# EAGLE schematic DP_current_measure_v3 (EAGLE 9.6.0)

## Sheet 1 of 5
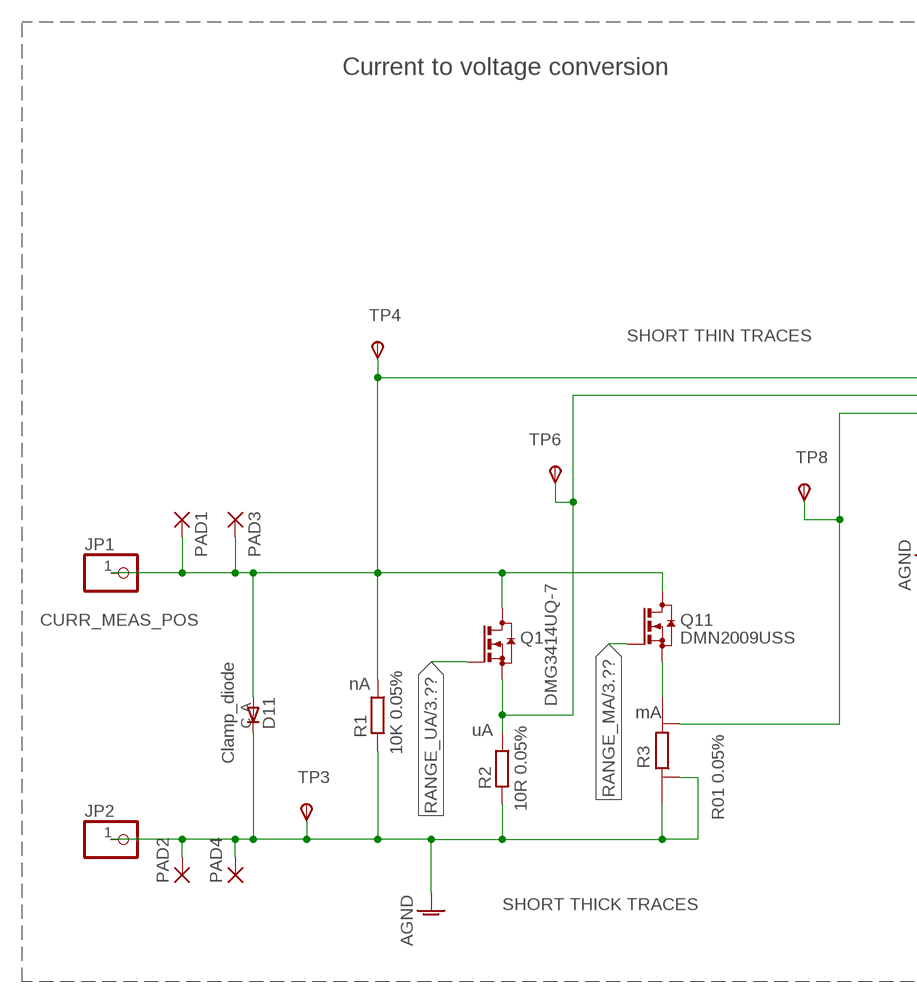
[diagram p0: schematic, sheet 1, part 1 of 2]
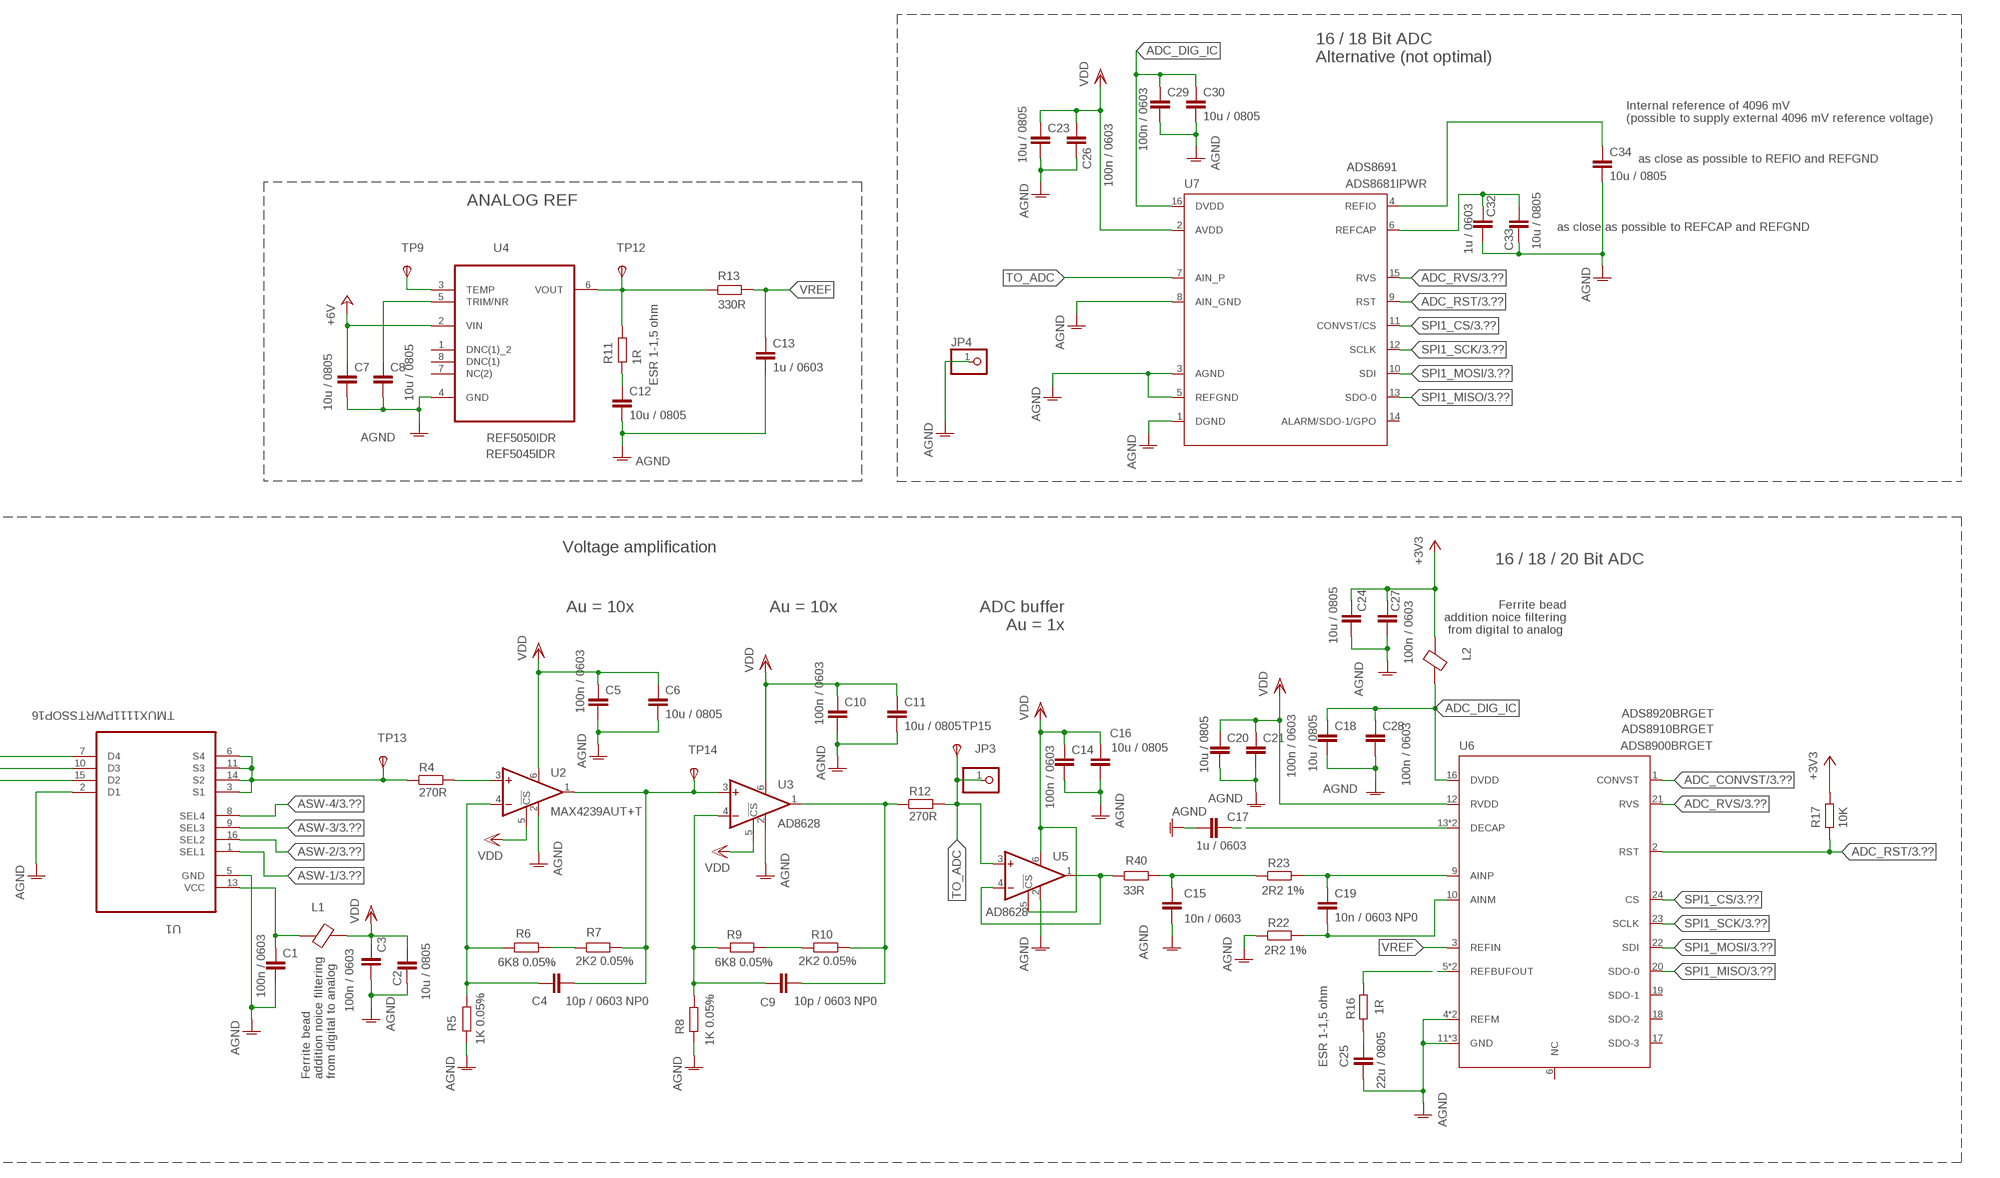
[diagram p1: schematic, sheet 1, part 2 of 2]

### Parts
C1  100n / 0603  C-EUC0603  [C0603]
C2  10u / 0805  C-EUC0805  [C0805]
C3  100n / 0603  C-EUC0603  [C0603]
C4  10p / 0603 NP0  C-EUC0603  [C0603]
C5  100n / 0603  C-EUC0603  [C0603]
C6  10u / 0805  C-EUC0805  [C0805]
C7  10u / 0805  C-EUC0805  [C0805]
C8  10u / 0805  C-EUC0805  [C0805]
C9  10p / 0603 NP0  C-EUC0603  [C0603]
C10  100n / 0603  C-EUC0603  [C0603]
C11  10u / 0805  C-EUC0805  [C0805]
C12  10u / 0805  C-EUC0805  [C0805]
C13  1u / 0603  C-EUC0603  [C0603]
C14  100n / 0603  C-EUC0603  [C0603]
C15  10n / 0603  C-EUC0603  [C0603]
C16  10u / 0805  C-EUC0805  [C0805]
C17  1u / 0603  C-EUC0603  [C0603]
C18  10u / 0805  C-EUC0805  [C0805]
C19  10n / 0603 NP0  C-EUC0603  [C0603]
C20  10u / 0805  C-EUC0805  [C0805]
C21  100n / 0603  C-EUC0603  [C0603]
C23  10u / 0805  C-EUC0805  [C0805]
C24  10u / 0805  C-EUC0805  [C0805]
C25  22u / 0805  C-EUC0805  [C0805]
C26  100n / 0603  C-EUC0603  [C0603]
C27  100n / 0603  C-EUC0603  [C0603]
C28  100n / 0603  C-EUC0603  [C0603]
C29  100n / 0603  C-EUC0603  [C0603]
C30  10u / 0805  C-EUC0805  [C0805]
C32  1u / 0603  C-EUC0603  [C0603]
C33  10u / 0805  C-EUC0805  [C0805]
C34  10u / 0805  C-EUC0805  [C0805]
D11  Clamp_diode  S1M  [DO214AC]
JP1  PINHD-1X1  [1X01]
JP2  PINHD-1X1  [1X01]
JP3  PINHD-1X1  [1X01]
JP4  PINHD-1X1  [1X01]
L1  BLM21PG331SN1D  [BLM21PG331SN1D]
L2  BLM21PG331SN1D  [BLM21PG331SN1D]
PAD1  WIREPADSMD2,54-5,08  [SMD2,54-5,08]
PAD2  WIREPADSMD2,54-5,08  [SMD2,54-5,08]
PAD3  WIREPADSMD2,54-5,08  [SMD2,54-5,08]
PAD4  WIREPADSMD2,54-5,08  [SMD2,54-5,08]
Q1  DMG3414UQ-7  [SOT23]
Q11  DMN2009USS  [SO8]
R1  10K 0.05%  R-EU_R0805  [R0805]
R2  10R 0.05%  R-EU_R0805  [R0805]
R3  R01 0.05%  CSM_R01  [R2512]
R4  270R  R-EU_R0603  [R0603]
R5  1K 0.05%  R-EU_R0603  [R0603]
R6  6K8 0.05%  R-EU_R0603  [R0603]
R7  2K2 0.05%  R-EU_R0603  [R0603]
R8  1K 0.05%  R-EU_R0603  [R0603]
R9  6K8 0.05%  R-EU_R0603  [R0603]
R10  2K2 0.05%  R-EU_R0603  [R0603]
R11  1R  R-EU_R0603  [R0603]
R12  270R  R-EU_R0603  [R0603]
R13  330R  R-EU_R0603  [R0603]
R16  1R  R-EU_R0603  [R0603]
R17  10K  R-EU_R0603  [R0603]
R22  2R2 1%  R-EU_R0603  [R0603]
R23  2R2 1%  R-EU_R0603  [R0603]
R40  33R  R-EU_R0603  [R0603]
TP3  TPSB1,27  [B1,27]
TP4  TPSB1,27  [B1,27]
TP6  TPSB1,27  [B1,27]
TP8  TPSB1,27  [B1,27]
TP9  TPSB1,27  [B1,27]
TP12  TPSB1,27  [B1,27]
TP13  TPSB1,27  [B1,27]
TP14  TPSB1,27  [B1,27]
TP15  TPSB1,27  [B1,27]
U1  TMUX1111PWRTSSOP16  [SOP65P640X110-16N]
U2  MAX4239AUT+T  [SOT23-6]
U3  AD8628  MAX4239AUT+T  [SOT23-6]
U4  REF5050IDR  [SOIC127P600X175-8N]
U5  AD8628  MAX4239AUT+T  [SOT23-6]
U6  ADS8900BRGET  ADS8910BRGET  [24-VFQFN]
U7  ADS8681IPWR  [SOP65P640X120-16N]

### Nets
+3V3: C24.1 C27.1 L2.2 R17.2 ; also sheet 2,3,4,5
+6V: C7.1 U4.2(VIN) ; also sheet 2
ADC_CONVST: U6.1(CONVST) ; also sheet 3
ADC_DIG_IC: C18.1 C28.1 C29.1 C30.1 L2.1 U6.16(DVDD) U7.16(DVDD)
ADC_RST: R17.1 U6.2(RST) U7.9(RST) ; also sheet 3
ADC_RVS: U6.21(RVS) U7.15(RVS) ; also sheet 3
AGND: C1.2 C2.2 C3.2 C5.2 C6.2 C7.2 C8.2 C10.2 C11.2 C12.2 C13.2 C14.2 C15.2 C16.2 C17.2 C18.2 C20.2 C21.2 C23.2 C24.2 C25.2 C26.2 C27.2 C28.2 C29.2 C30.2 C32.2 C33.2 C34.2 D11.C JP2.1 JP4.1 PAD2.1(P) PAD4.1(P) R1.2 R2.2 R3.E1 R3.I1 R5.1 R8.2 R22.1 TP3.TP(PP) U1.2(D1) U1.5(GND) U2.2(V-) U3.2(V-) U4.4(GND) U5.2(V-) U6.4(REFM) U6.8(REFM) U6.11(GND) U6.15(GND) U6.25(GND) U7.1(DGND) U7.3(AGND) U7.5(REFGND) U7.8(AIN_GND) ; also sheet 2,3
ASW-1: U1.1(SEL1) ; also sheet 3
ASW-2: U1.16(SEL2) ; also sheet 3
ASW-3: U1.9(SEL3) ; also sheet 3
ASW-4: U1.8(SEL4) ; also sheet 3
CURR_MEAS_POS: D11.A JP1.1 PAD1.1(P) PAD3.1(P) Q1.3(D) Q11.5(D) Q11.6(D) Q11.7(D) Q11.8(D) R1.1 TP4.TP(PP) U1.7(D4)
MA_RANGE_SENSE: R3.E2 TP8.TP(PP) U1.15(D2)
MA_RANGE_SENSE_Q: Q11.1(S) Q11.2(S) Q11.3(S) R3.I2
N$1: C9.2 R10.1 R12.1 U3.1(OUT)
N$2: R9.1 R10.2
N$3: C9.1 R8.1 R9.2 U3.4(-IN)
N$4: R6.2 R7.1
N$5: C4.2 R7.2 TP14.TP(PP) U2.1(OUT) U3.3(+IN)
N$6: R4.1 TP13.TP(PP) U1.3(S1) U1.6(S4) U1.11(S3) U1.14(S2)
N$7: C4.1 R5.2 R6.1 U2.4(-IN)
N$8: C1.1 L1.1 U1.13(VCC)
N$14: C15.1 R23.1 R40.2
N$15: R4.2 U2.3(+IN)
N$17: C19.2 R22.2 U6.10(AINM)
N$24: C8.1 U4.5(TRIM/NR)
N$40: C32.1 C33.1 U7.6(REFCAP)
N$41: C34.1 U7.4(REFIO)
N$47: TP9.TP(PP) U4.3(TEMP)
N$48: R16.2 U6.5(REFBUFOUT) U6.7(REFBUFOUT)
N$49: C25.1 R16.1
N$50: C17.1 U6.13(DECAP) U6.14(DECAP)
N$51: R40.1 U5.1(OUT) U5.4(-IN)
N$59: C12.1 R11.2
N$62: C19.1 R23.2 U6.9(AINP)
RANGE_MA: Q11.4(G) ; also sheet 3
RANGE_UA: Q1.1(G) ; also sheet 3
SPI1_CS: U6.24(CS) U7.11(CONVST/CS) ; also sheet 3
SPI1_MISO: U6.20(SDO-0) U7.13(SDO-0) ; also sheet 3
SPI1_MOSI: U6.22(SDI) U7.10(SDI) ; also sheet 3
SPI1_SCK: U6.23(SCLK) U7.12(SCLK) ; also sheet 3
TO_ADC: JP3.1 R12.2 TP15.TP(PP) U5.3(+IN) U7.7(AIN_P)
UA_RANGE_SENSE: Q1.2(S) R2.1 TP6.TP(PP) U1.10(D3)
VDD: C2.1 C3.1 C5.1 C6.1 C10.1 C11.1 C14.1 C16.1 C20.1 C21.1 C23.1 C26.1 L1.2 U2.5(!CS) U2.6(V+) U3.5(!CS) U3.6(V+) U5.5(!CS) U5.6(V+) U6.12(RVDD) U7.2(AVDD) ; also sheet 2
VREF: C13.1 R13.2 U6.3(REFIN)
VREF_IC: R11.1 R13.1 TP12.TP(PP) U4.6(VOUT)
Unconnected: U4.1(DNC(1)_2) U4.7(NC(2)) U4.8(DNC(1)) U6.6(NC) U6.17(SDO-3) U6.18(SDO-2) U6.19(SDO-1) U7.14(ALARM/SDO-1/GPO)

### Notes on the sheet
- 16 / 18 Bit ADC
  Alternative (not optimal)
- Internal reference of 4096 mV 
  (possible to supply external 4096 mV reference voltage)
- as close as possible to REFIO and REFGND
- ADS8691
- ANALOG REF
- as close as possible to REFCAP and REFGND
- ESR 1-1,5 ohm
- REF5045IDR
- Current to voltage conversion | Voltage amplification
- 16 / 18 / 20 Bit ADC
- Au = 10x | Au = 10x
- ADC buffer
  Au = 1x
- Ferrite bead
  addition noice filtering
  from digital to analog
- ADS8920BRGET
- SHORT THIN TRACES | ADS8910BRGET
- nA
- mA
- uA
- ESR 1-1,5 ohm
- Ferrite bead
  addition noice filtering
  from digital to analog
- SHORT THICK TRACES

## Sheet 2 of 5
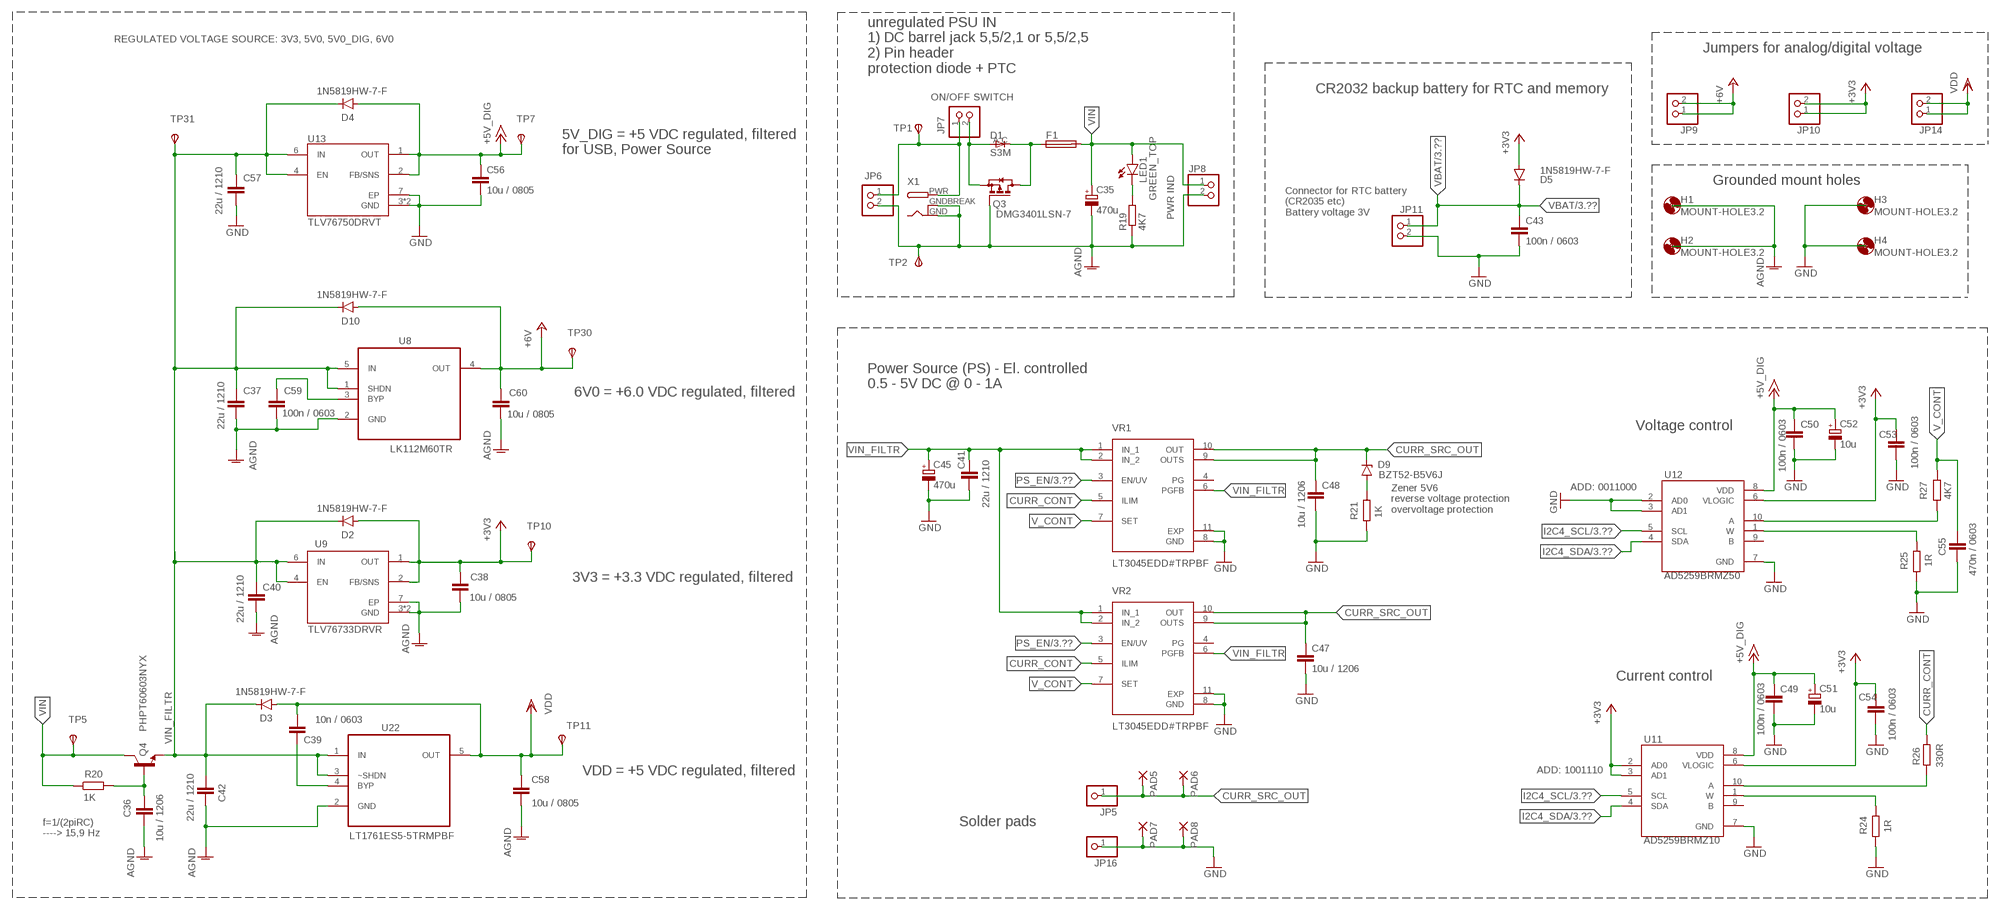
[diagram p2: schematic, sheet 2]

### Parts
C35  470u  CPOL-EUG  [PANASONIC_G]
C36  10u / 1206  C-EUC1206  [C1206]
C37  22u / 1210  C-EUC1210  [C1210]
C38  10u / 0805  C-EUC0805  [C0805]
C39  10n / 0603  C-EUC0603  [C0603]
C40  22u / 1210  C-EUC1210  [C1210]
C41  22u / 1210  C-EUC1210  [C1210]
C42  22u / 1210  C-EUC1210  [C1210]
C43  100n / 0603  C-EUC0603  [C0603]
C45  470u  CPOL-EUG  [PANASONIC_G]
C47  10u / 1206  C-EUC1206  [C1206]
C48  10u / 1206  C-EUC1206  [C1206]
C49  100n / 0603  C-EUC0603  [C0603]
C50  100n / 0603  C-EUC0603  [C0603]
C51  10u  CPOL-EUSMCB  [SMC_B]
C52  10u  CPOL-EUSMCB  [SMC_B]
C53  100n / 0603  C-EUC0603  [C0603]
C54  100n / 0603  C-EUC0603  [C0603]
C55  470n / 0603  C-EUC0603  [C0603]
C56  10u / 0805  C-EUC0805  [C0805]
C57  22u / 1210  C-EUC1210  [C1210]
C58  10u / 0805  C-EUC0805  [C0805]
C59  100n / 0603  C-EUC0603  [C0603]
C60  10u / 0805  C-EUC0805  [C0805]
D1  S3M  S1M  [DO214AC]
D2  1N5819HW-7-F  CGRM4001-G  [SOD-123_MINI-SMA]
D3  1N5819HW-7-F  CGRM4001-G  [SOD-123_MINI-SMA]
D4  1N5819HW-7-F  CGRM4001-G  [SOD-123_MINI-SMA]
D5  1N5819HW-7-F  CGRM4001-G  [SOD-123_MINI-SMA]
D9  BZT52-B5V6J  ZENER_MMSZ5240BTDO-219-AB(SOD123F)  [SODFL3718X115]
D10  1N5819HW-7-F  CGRM4001-G  [SOD-123_MINI-SMA]
F1  MF-MSMF050-2  [1812]
H1  MOUNT-HOLE3.2  [3,2]
H2  MOUNT-HOLE3.2  [3,2]
H3  MOUNT-HOLE3.2  [3,2]
H4  MOUNT-HOLE3.2  [3,2]
JP5  PINHD-1X1  [1X01]
JP6  PINHD-1X2  [1X02]
JP7  PINHD-1X2  [1X02]
JP8  PINHD-1X2  [1X02]
JP9  PINHD-1X2  [1X02]
JP10  PINHD-1X2  [1X02]
JP11  PINHD-1X2  [1X02]
JP14  PINHD-1X2  [1X02]
JP16  PINHD-1X1  [1X01]
LED1  GREEN_TOP  LEDCHIP-LED0603  [CHIP-LED0603]
PAD5  WIREPADSMD2,54-5,08  [SMD2,54-5,08]
PAD6  WIREPADSMD2,54-5,08  [SMD2,54-5,08]
PAD7  WIREPADSMD2,54-5,08  [SMD2,54-5,08]
PAD8  WIREPADSMD2,54-5,08  [SMD2,54-5,08]
Q3  DMG3401LSN-7  [SOT23]
Q4  PHPT60603NYX  [TO127P600X120-5N]
R19  4K7  R-EU_R0603  [R0603]
R20  1K  R-EU_R0603  [R0603]
R21  1K  R-EU_R0603  [R0603]
R24  1R  R-EU_R0603  [R0603]
R25  1R  R-EU_R0603  [R0603]
R26  330R  R-EU_R0603  [R0603]
R27  4K7  R-EU_R0603  [R0603]
TP1  TPSB1,27  [B1,27]
TP2  TPSB1,27  [B1,27]
TP5  TPSB1,27  [B1,27]
TP7  TPSB1,27  [B1,27]
TP10  TPSB1,27  [B1,27]
TP11  TPSB1,27  [B1,27]
TP30  TPSB1,27  [B1,27]
TP31  TPSB1,27  [B1,27]
U8  LK112M60TR  [SOT23-5]
U9  TLV76733DRVR  TLV76701DRVT  [SON65P200X200X80-7N]
U11  AD5259BRMZ10  AD5259BRMZ5  [SOP50P490X95-10N]
U12  AD5259BRMZ50  AD5259BRMZ5  [SOP50P490X95-10N]
U13  TLV76750DRVT  TLV76701DRVT  [SON65P200X200X80-7N]
U22  LT1761ES5-5TRMPBF  [SOT95P280X100-5N]
VR1  LT3045EDD#TRPBF  [SON50P300X300X80-11N]
VR2  LT3045EDD#TRPBF  [SON50P300X300X80-11N]
X1  DCBARRELPTH  [DCJACK_2MM_PTH]

### Nets
+3V3: C38.1 C53.1 C54.1 D2.A D5.A JP10.1 JP10.2 TP10.TP(PP) U9.1(OUT) U9.2(FB/SNS) U11.2(AD0) U11.3(AD1) U11.6(VLOGIC) U12.6(VLOGIC) ; also sheet 1,3,4,5
+5V_DIG: C49.1 C50.1 C51.+ C52.+ C56.1 D4.A TP7.TP(PP) U11.8(VDD) U12.8(VDD) U13.1(OUT) U13.2(FB/SNS) ; also sheet 4
+6V: C60.1 D10.A JP9.1 JP9.2 TP30.TP(PP) U8.4(OUT) ; also sheet 1
AGND: C35.- C36.2 C37.2 C38.2 C40.2 C42.2 C58.2 C59.2 C60.2 JP6.2 JP8.2 Q3.1(G) R19.1 TP2.TP(PP) U8.2(GND) U9.3(GND) U9.5(GND) U9.7(EP) U22.2(GND) X1.GND X1.GNDBREAK ; also sheet 1,3
CURR_CONT: R26.2 VR1.5(ILIM) VR2.5(ILIM)
CURR_CONT_LOW: R24.2 U11.1(W)
CURR_POT_HIGH: R26.1 U11.10(A)
CURR_SRC_OUT: C47.1 C48.1 D9.2(C) JP5.1 PAD5.1(P) PAD6.1(P) VR1.9(OUTS) VR1.10(OUT) VR2.9(OUTS) VR2.10(OUT)
GND: C41.2 C43.2 C45.- C47.2 C48.2 C49.2 C50.2 C51.- C52.- C53.2 C54.2 C55.2 C56.2 C57.2 JP11.2 JP16.1 PAD7.1(P) PAD8.1(P) R21.1 R24.1 R25.1 U11.7(GND) U12.2(AD0) U12.3(AD1) U12.7(GND) U13.3(GND) U13.5(GND) U13.7(EP) VR1.8(GND) VR1.11(EXP) VR2.8(GND) VR2.11(EXP) ; also sheet 3,4,5
I2C4_SCL: U11.5(SCL) U12.5(SCL) ; also sheet 3,4
I2C4_SDA: U11.4(SDA) U12.4(SDA) ; also sheet 3,4
N$16: D9.1(A) R21.2
N$20: C59.1 U8.3(BYP)
N$23: C36.1 Q4.4(B) R20.2
N$39: D1.C F1.1 Q3.3(D)
N$42: D1.A JP7.2 Q3.2(S)
N$44: LED1.C R19.2
N$63: JP6.1 JP7.1 TP1.TP(PP) X1.PWR
PS_EN: VR1.3(EN/UV) VR2.3(EN/UV) ; also sheet 3
REG_BYPAS: C39.1 U22.4(BYP)
V_CONT: C55.1 R27.2 VR1.7(SET) VR2.7(SET)
V_CONT_LOW: R25.2 U12.1(W)
V_POT_HIGH: R27.1 U12.10(A)
VBAT: C43.1 D5.C JP11.1 ; also sheet 3
VDD: C39.2 C58.1 D3.A JP14.1 JP14.2 TP11.TP(PP) U22.5(OUT) ; also sheet 1
VIN: C35.+ F1.2 JP8.1 LED1.A Q4.5(C) R20.1 TP5.TP(PP)
VIN_FILTR: C37.1 C40.1 C41.1 C42.1 C45.+ C57.1 D2.C D3.C D4.C D10.C Q4.1(E) Q4.2(E) Q4.3(E) TP31.TP(PP) U8.1(SHDN) U8.5(IN) U9.4(EN) U9.6(IN) U13.4(EN) U13.6(IN) U22.1(IN) U22.3(~SHDN) VR1.1(IN_1) VR1.2(IN_2) VR1.6(PGFB) VR2.1(IN_1) VR2.2(IN_2) VR2.6(PGFB)
Unconnected: U11.9(B) U12.9(B) VR1.4(PG) VR2.4(PG)

### Notes on the sheet
- REGULATED VOLTAGE SOURCE: 3V3, 5V0, 5V0_DIG, 6V0
- Jumpers for analog/digital voltage
- unregulated PSU IN
  1) DC barrel jack 5,5/2,1 or 5,5/2,5
  2) Pin header
  protection diode + PTC
- CR2032 backup battery for RTC and memory
- ON/OFF SWITCH
- 5V_DIG = +5 VDC regulated, filtered
  for USB, Power Source
- Grounded mount holes
- Connector for RTC battery
  (CR2035 etc)
  Battery voltage 3V
- PWR IND
- Power Source (PS) - El. controlled
  0.5 - 5V DC @ 0 - 1A
- 6V0 = +6.0 VDC regulated, filtered
- Voltage control
- ADD: 0011000
- Zener 5V6
  reverse voltage protection
  overvoltage protection
- 3V3 = +3.3 VDC regulated, filtered
- Current control
- VDD = +5 VDC regulated, filtered | ADD: 1001110
- Solder pads
- f=1/(2piRC) 
  ----> 15,9 Hz

## Sheet 3 of 5
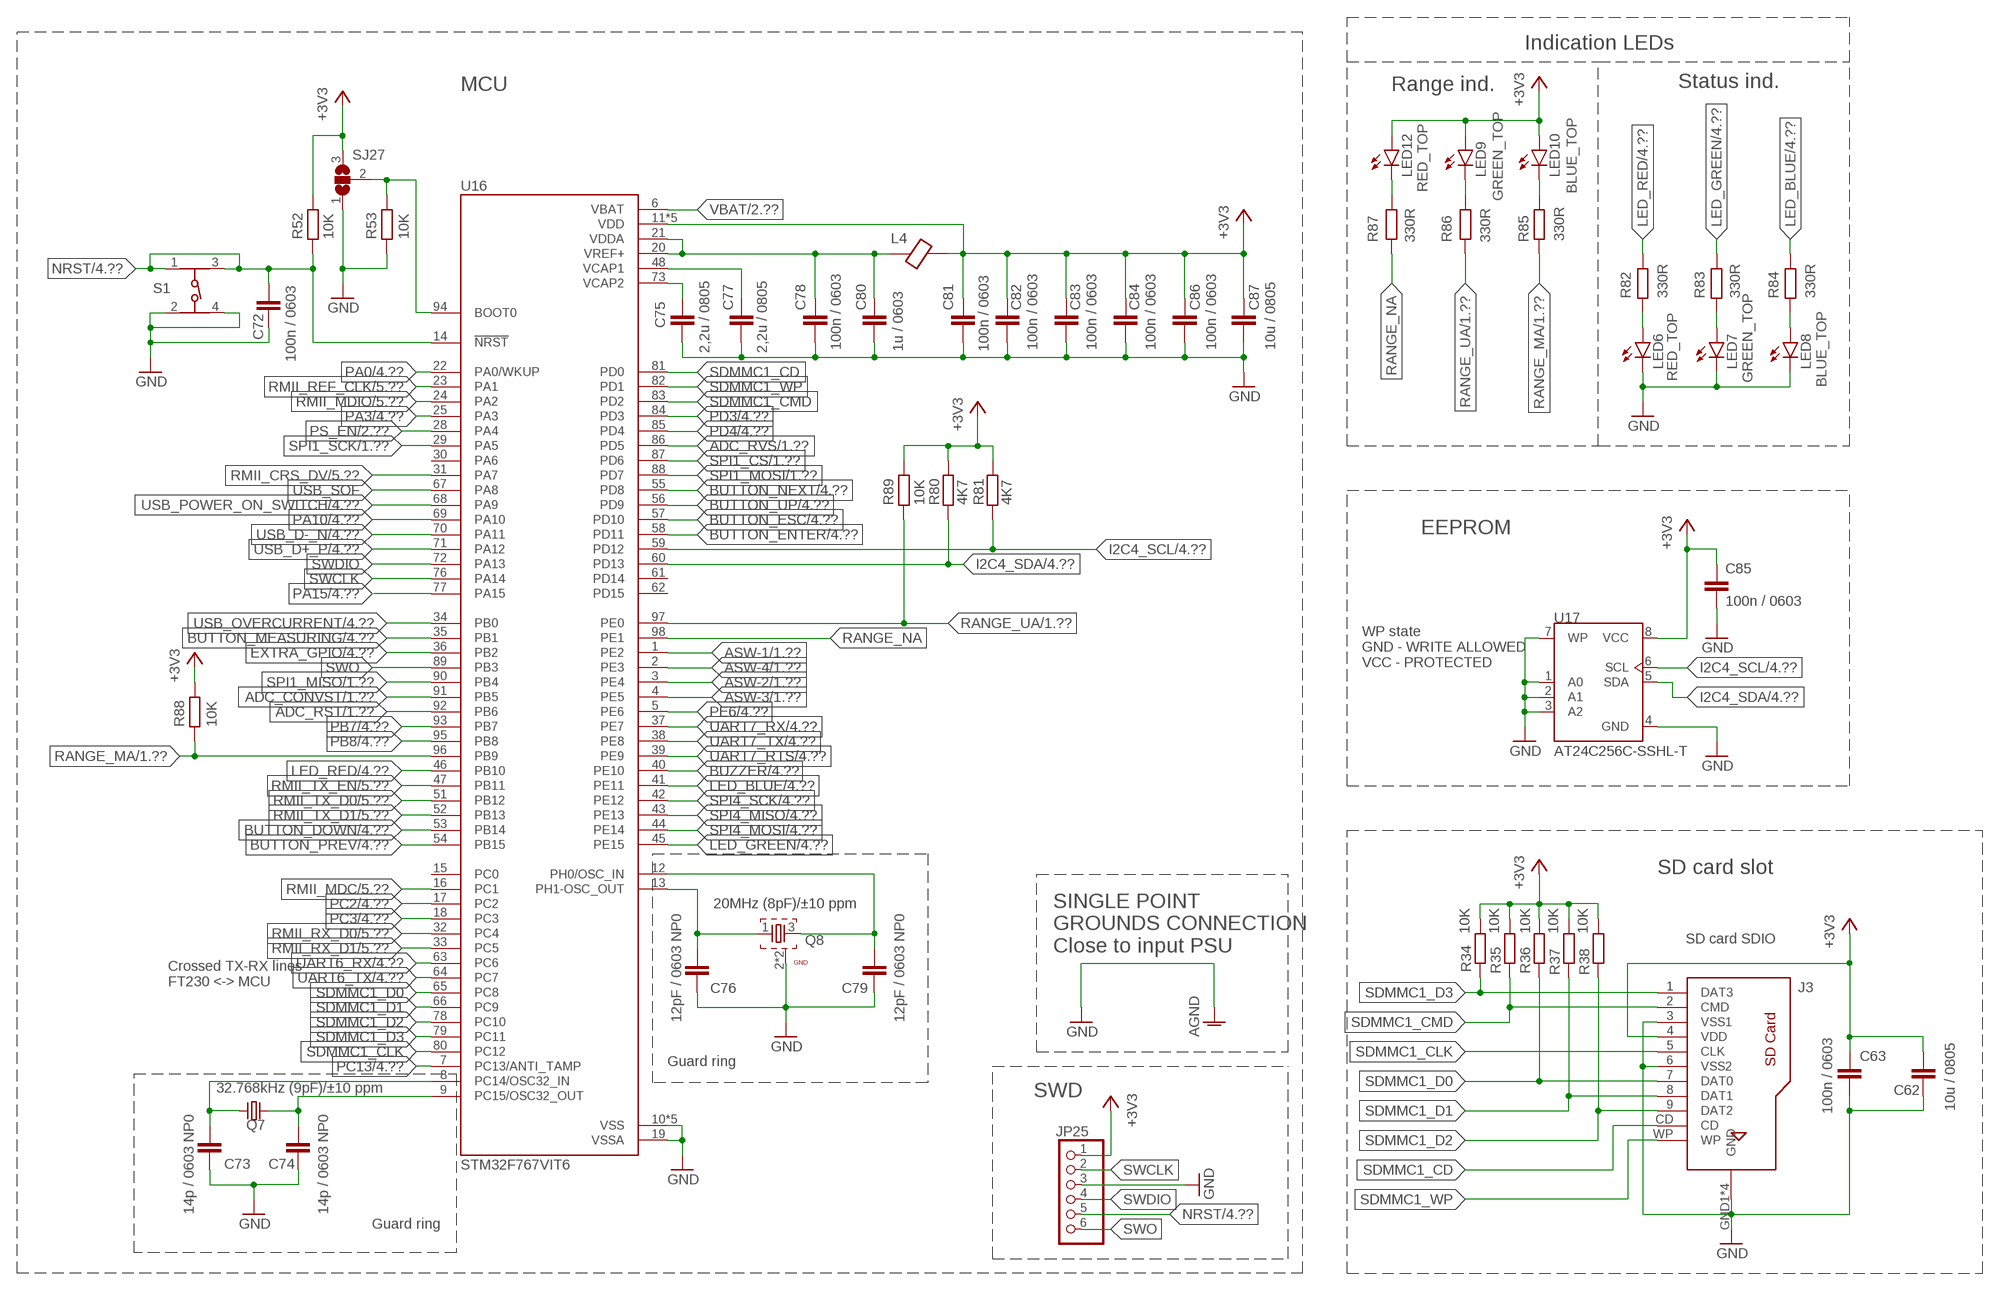
[diagram p3: schematic, sheet 3]

### Parts
C62  10u / 0805  C-EUC0805  [C0805]
C63  100n / 0603  C-EUC0603  [C0603]
C72  100n / 0603  C-EUC0603  [C0603]
C73  14p / 0603 NP0  C-EUC0603  [C0603]
C74  14p / 0603 NP0  C-EUC0603  [C0603]
C75  2,2u / 0805  C-EUC0805  [C0805]
C76  12pF / 0603 NP0  C-EUC0603  [C0603]
C77  2,2u / 0805  C-EUC0805  [C0805]
C78  100n / 0603  C-EUC0603  [C0603]
C79  12pF / 0603 NP0  C-EUC0603  [C0603]
C80  1u / 0603  C-EUC0603  [C0603]
C81  100n / 0603  C-EUC0603  [C0603]
C82  100n / 0603  C-EUC0603  [C0603]
C83  100n / 0603  C-EUC0603  [C0603]
C84  100n / 0603  C-EUC0603  [C0603]
C85  100n / 0603  C-EUC0603  [C0603]
C86  100n / 0603  C-EUC0603  [C0603]
C87  10u / 0805  C-EUC0805  [C0805]
J3  693063020911  [693063020911]
JP25  PINHD-1X6  [1X06]
L4  BLM21PG331SN1D  [BLM21PG331SN1D]
LED6  RED_TOP  LEDCHIP-LED0603  [CHIP-LED0603]
LED7  GREEN_TOP  LEDCHIP-LED0603  [CHIP-LED0603]
LED8  BLUE_TOP  LEDCHIP-LED0603  [CHIP-LED0603]
LED9  GREEN_TOP  LEDCHIP-LED0603  [CHIP-LED0603]
LED10  BLUE_TOP  LEDCHIP-LED0603  [CHIP-LED0603]
LED12  RED_TOP  LEDCHIP-LED0603  [CHIP-LED0603]
Q7  32.768kHz (9pF)/±10 ppm  WE-XTAL_IQXC-25_830062558  [WE-XTAL_IQXC-25]
Q8  20MHz (8pF)/±10 ppm  WE-XTAL_CFPX-218_830069381  [WE-XTAL_CFPX-218]
R34  10K  R-EU_R0603  [R0603]
R35  10K  R-EU_R0603  [R0603]
R36  10K  R-EU_R0603  [R0603]
R37  10K  R-EU_R0603  [R0603]
R38  10K  R-EU_R0603  [R0603]
R52  10K  R-EU_R0603  [R0603]
R53  10K  R-EU_R0603  [R0603]
R80  4K7  R-EU_R0603  [R0603]
R81  4K7  R-EU_R0603  [R0603]
R82  330R  R-EU_R0603  [R0603]
R83  330R  R-EU_R0603  [R0603]
R84  330R  R-EU_R0603  [R0603]
R85  330R  R-EU_R0603  [R0603]
R86  330R  R-EU_R0603  [R0603]
R87  330R  R-EU_R0603  [R0603]
R88  10K  R-EU_R0603  [R0603]
R89  10K  R-EU_R0603  [R0603]
S1  430152080836  [430152080836]
SJ27  SJ2W  [SJ_2]
U16  STM32F767VIT6  STM32F745VET6  [QFP50P1600X1600X160-100N]
U17  AT24C256C-SSHL-T  [SOIC127P600X175-8N]

### Nets
+3V3: C62.1 C63.1 C81.1 C82.1 C83.1 C84.1 C85.1 C86.1 C87.1 J3.4(VDD) JP25.1 L4.1 LED9.A LED10.A LED12.A R34.2 R35.2 R36.2 R37.2 R38.2 R52.2 R80.2 R81.2 R88.2 R89.2 SJ27.3 U16.11(VDD) U16.27(VDD) U16.50(VDD) U16.75(VDD) U16.100(VDD) U17.8(VCC) ; also sheet 1,2,4,5
ADC_CONVST: U16.91(PB5) ; also sheet 1
ADC_RST: U16.92(PB6) ; also sheet 1
ADC_RVS: U16.86(PD5) ; also sheet 1
ASW-1: U16.1(PE2) ; also sheet 1
ASW-2: U16.3(PE4) ; also sheet 1
ASW-3: U16.4(PE5) ; also sheet 1
ASW-4: U16.2(PE3) ; also sheet 1
BUTTON_DOWN: U16.53(PB14) ; also sheet 4
BUTTON_ENTER: U16.58(PD11) ; also sheet 4
BUTTON_ESC: U16.57(PD10) ; also sheet 4
BUTTON_MEASURING: U16.35(PB1) ; also sheet 4
BUTTON_NEXT: U16.55(PD8) ; also sheet 4
BUTTON_PREV: U16.54(PB15) ; also sheet 4
BUTTON_UP: U16.56(PD9) ; also sheet 4
BUZZER: U16.40(PE10) ; also sheet 4
EXTRA_GPIO: U16.36(PB2) ; also sheet 4
GND: C62.2 C63.2 C72.2 C73.2 C74.2 C75.2 C76.2 C77.2 C78.2 C79.2 C80.2 C81.2 C82.2 C83.2 C84.2 C85.2 C86.2 C87.2 J3.3(VSS1) J3.6(VSS2) J3.GND1(GND) J3.GND2(GND) J3.GND3(GND) J3.GND4(GND) JP25.3 LED6.C LED7.C LED8.C Q8.2(GND) Q8.4(GND) R53.1 S1.2 S1.4 SJ27.1 U16.10(VSS) U16.19(VSSA) U16.26(VSS) U16.49(VSS) U16.74(VSS) U16.99(VSS) U17.1(A0) U17.2(A1) U17.3(A2) U17.4(GND) U17.7(WP) ; also sheet 2,4,5
I2C4_SCL: R81.1 U16.59(PD12) U17.6(SCL) ; also sheet 2,4
I2C4_SDA: R80.1 U16.60(PD13) U17.5(SDA) ; also sheet 2,4
LED_BLUE: R84.2 U16.41(PE11) ; also sheet 4
LED_GREEN: R83.2 U16.45(PE15) ; also sheet 4
LED_RED: R82.2 U16.46(PB10) ; also sheet 4
N$13: C76.1 Q8.1 U16.13(PH1-OSC_OUT)
N$18: C79.1 Q8.3 U16.12(PH0/OSC_IN)
N$56: C74.1 Q7.2 U16.9(PC15/OSC32_OUT)
N$57: C73.1 Q7.1 U16.8(PC14/OSC32_IN)
N$61: C75.1 U16.73(VCAP2)
N$64: C77.1 U16.48(VCAP1)
N$66: R53.2 SJ27.2 U16.94(BOOT0)
N$67: C78.1 C80.1 L4.2 U16.20(VREF+) U16.21(VDDA)
N$68: LED8.A R84.1
N$72: LED7.A R83.1
N$74: LED6.A R82.1
N$85: LED12.C R87.1
N$86: LED9.C R86.1
N$87: LED10.C R85.1
NRST: C72.1 JP25.5 R52.1 S1.1 S1.3 U16.14(!NRST) ; also sheet 4
PA0: U16.22(PA0/WKUP) ; also sheet 4
PA3: U16.25(PA3) ; also sheet 4
PA10: U16.69(PA10) ; also sheet 4
PA15: U16.77(PA15) ; also sheet 4
PB7: U16.93(PB7) ; also sheet 4
PB8: U16.95(PB8) ; also sheet 4
PC2: U16.17(PC2) ; also sheet 4
PC3: U16.18(PC3) ; also sheet 4
PC13: U16.7(PC13/ANTI_TAMP) ; also sheet 4
PD3: U16.84(PD3) ; also sheet 4
PD4: U16.85(PD4) ; also sheet 4
PE6: U16.5(PE6) ; also sheet 4
PS_EN: U16.28(PA4) ; also sheet 2
RANGE_MA: R85.2 R88.1 U16.96(PB9) ; also sheet 1
RANGE_NA: R87.2 U16.98(PE1)
RANGE_UA: R86.2 R89.1 U16.97(PE0) ; also sheet 1
RMII_CRS_DV: U16.31(PA7) ; also sheet 5
RMII_MDC: U16.16(PC1) ; also sheet 5
RMII_MDIO: U16.24(PA2) ; also sheet 5
RMII_REF_CLK: U16.23(PA1) ; also sheet 5
RMII_RX_D0: U16.32(PC4) ; also sheet 5
RMII_RX_D1: U16.33(PC5) ; also sheet 5
RMII_TX_D0: U16.51(PB12) ; also sheet 5
RMII_TX_D1: U16.52(PB13) ; also sheet 5
RMII_TX_EN: U16.47(PB11) ; also sheet 5
SDMMC1_CD: J3.CD U16.81(PD0)
SDMMC1_CLK: J3.5(CLK) U16.80(PC12)
SDMMC1_CMD: J3.2(CMD) R35.1 U16.83(PD2)
SDMMC1_D0: J3.7(DAT0) R36.1 U16.65(PC8)
SDMMC1_D1: J3.8(DAT1) R37.1 U16.66(PC9)
SDMMC1_D2: J3.9(DAT2) R38.1 U16.78(PC10)
SDMMC1_D3: J3.1(DAT3) R34.1 U16.79(PC11)
SDMMC1_WP: J3.WP U16.82(PD1)
SPI1_CS: U16.87(PD6) ; also sheet 1
SPI1_MISO: U16.90(PB4) ; also sheet 1
SPI1_MOSI: U16.88(PD7) ; also sheet 1
SPI1_SCK: U16.29(PA5) ; also sheet 1
SPI4_MISO: U16.43(PE13) ; also sheet 4
SPI4_MOSI: U16.44(PE14) ; also sheet 4
SPI4_SCK: U16.42(PE12) ; also sheet 4
SWCLK: JP25.2 U16.76(PA14)
SWDIO: JP25.4 U16.72(PA13)
SWO: JP25.6 U16.89(PB3)
UART6_RX: U16.63(PC6) ; also sheet 4
UART6_TX: U16.64(PC7) ; also sheet 4
UART7_RTS: U16.39(PE9) ; also sheet 4
UART7_RX: U16.37(PE7) ; also sheet 4
UART7_TX: U16.38(PE8) ; also sheet 4
USB_D+_P: U16.71(PA12) ; also sheet 4
USB_D-_N: U16.70(PA11) ; also sheet 4
USB_OVERCURRENT: U16.34(PB0) ; also sheet 4
USB_POWER_ON_SWITCH: U16.68(PA9) ; also sheet 4
USB_SOF: U16.67(PA8)
VBAT: U16.6(VBAT) ; also sheet 2
Unconnected: U16.15(PC0) U16.30(PA6) U16.61(PD14) U16.62(PD15)

### Notes on the sheet
- Indication LEDs
- MCU | Range ind. | Status ind.
- EEPROM
- WP state
  GND - WRITE ALLOWED
  VCC - PROTECTED
- SD card slot
- SD card SDIO
- SINGLE POINT
  GROUNDS CONNECTION
  Close to input PSU
- Crossed TX-RX lines
  FT230 <-> MCU
- Guard ring
- SWD
- Guard ring

## Sheet 4 of 5
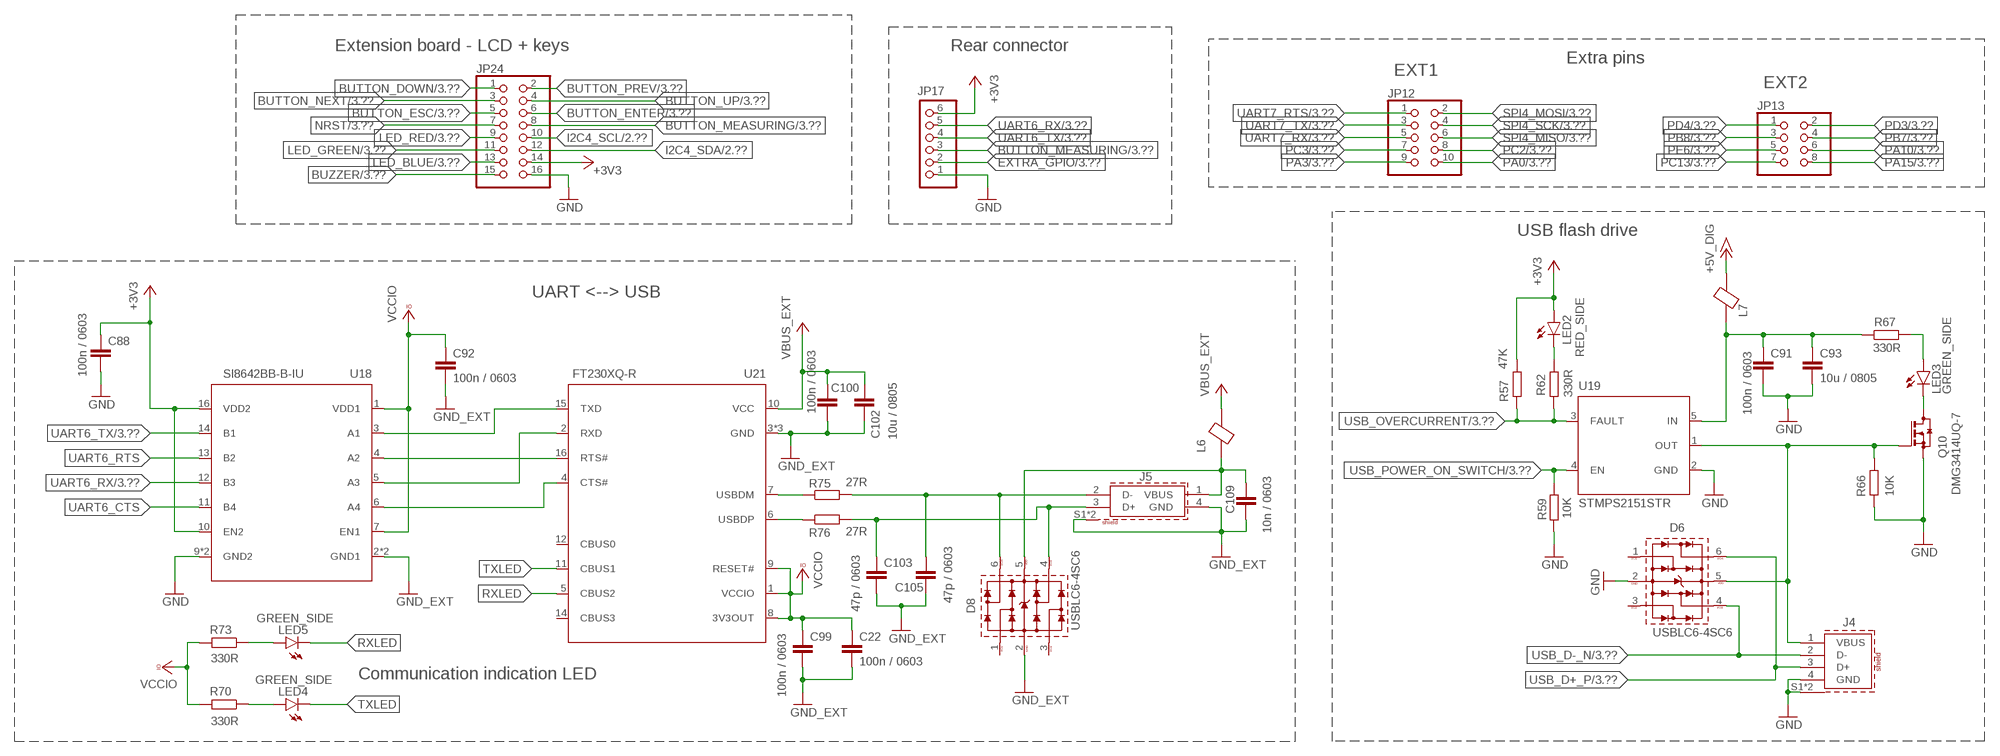
[diagram p4: schematic, sheet 4]

### Parts
C22  100n / 0603  C-EUC0603  [C0603]
C88  100n / 0603  C-EUC0603  [C0603]
C91  100n / 0603  C-EUC0603  [C0603]
C92  100n / 0603  C-EUC0603  [C0603]
C93  10u / 0805  C-EUC0805  [C0805]
C99  100n / 0603  C-EUC0603  [C0603]
C100  100n / 0603  C-EUC0603  [C0603]
C102  10u / 0805  C-EUC0805  [C0805]
C103  47p / 0603  C-EUC0603  [C0603]
C105  47p / 0603  C-EUC0603  [C0603]
C109  10n / 0603  C-EUC0603  [C0603]
D6  USBLC6-4SC6  WE-TVS-HS_SOT23-6L_824015  [WE-TVS_SOT23-6L]
D8  USBLC6-4SC6  WE-TVS-HS_SOT23-6L_824015  [WE-TVS_SOT23-6L]
J4  614004190021  [614004190021]
J5  61400416121  [61400416121]
JP12  PINHD-2X5  [2X05]
JP13  PINHD-2X4  [2X04]
JP17  PINHD-1X6  [1X06]
JP24  PINHD-2X8  [2X08]
L6  BLM21PG331SN1D  [BLM21PG331SN1D]
L7  BLM21PG331SN1D  [BLM21PG331SN1D]
LED2  RED_SIDE  LEDCHIP-LED0603  [CHIP-LED0603]
LED3  GREEN_SIDE  LEDCHIP-LED0603  [CHIP-LED0603]
LED4  GREEN_SIDE  LEDCHIP-LED0603  [CHIP-LED0603]
LED5  GREEN_SIDE  LEDCHIP-LED0603  [CHIP-LED0603]
Q10  DMG3414UQ-7  [SOT23]
R57  47K  R-EU_R0603  [R0603]
R59  10K  R-EU_R0603  [R0603]
R62  330R  R-EU_R0603  [R0603]
R66  10K  R-EU_R0603  [R0603]
R67  330R  R-EU_R0603  [R0603]
R70  330R  R-EU_R0603  [R0603]
R73  330R  R-EU_R0603  [R0603]
R75  27R  R-EU_R0603  [R0603]
R76  27R  R-EU_R0603  [R0603]
U18  SI8642BB-B-IU  [QSOP16]
U19  STMPS2151STR  [SOT-23-5]
U21  FT230XQ-R  FT232XQ-R  [QFN16-4X4]

### Nets
+3V3: C88.1 JP17.6 JP24.14 LED2.A R57.1 U18.10(EN2) U18.16(VDD2) ; also sheet 1,2,3,5
+5V_DIG: L7.1 ; also sheet 2
BUTTON_DOWN: JP24.1 ; also sheet 3
BUTTON_ENTER: JP24.6 ; also sheet 3
BUTTON_ESC: JP24.5 ; also sheet 3
BUTTON_MEASURING: JP17.3 JP24.8 ; also sheet 3
BUTTON_NEXT: JP24.3 ; also sheet 3
BUTTON_PREV: JP24.2 ; also sheet 3
BUTTON_UP: JP24.4 ; also sheet 3
BUZZER: JP24.15 ; also sheet 3
CTS: U18.6(A4) U21.4(CTS#)
EXTRA_GPIO: JP17.2 ; also sheet 3
GND: C88.2 C91.2 C93.2 D6.2(GND) J4.4(GND) J4.S1(SHIELD) J4.S2(SHIELD) JP17.1 JP24.16 Q10.2(S) R59.2 R66.2 U18.9(GND2) U18.15(GND2) U19.2(GND) ; also sheet 2,3,5
GND_EXT: C22.2 C92.2 C99.2 C100.2 C102.2 C103.2 C105.2 C109.2 D8.2(GND) J5.4(GND) J5.S1(SHIELD) J5.S2(SHIELD) U18.2(GND1) U18.8(GND1) U21.3(GND) U21.13(GND) U21.EXP(GND)
I2C4_SCL: JP24.10 ; also sheet 2,3
I2C4_SDA: JP24.12 ; also sheet 2,3
LED_BLUE: JP24.13 ; also sheet 3
LED_GREEN: JP24.11 ; also sheet 3
LED_RED: JP24.9 ; also sheet 3
N$58: LED4.A R70.1
N$60: LED5.A R73.1
N$70: LED3.A R67.2
N$73: LED3.C Q10.3(D)
N$78: LED2.C R62.1
N$82: C91.1 C93.1 L7.2 R67.1 U19.5(IN)
NRST: JP24.7 ; also sheet 3
PA0: JP12.10 ; also sheet 3
PA3: JP12.9 ; also sheet 3
PA10: JP13.6 ; also sheet 3
PA15: JP13.8 ; also sheet 3
PB7: JP13.4 ; also sheet 3
PB8: JP13.3 ; also sheet 3
PC2: JP12.8 ; also sheet 3
PC3: JP12.7 ; also sheet 3
PC13: JP13.7 ; also sheet 3
PD3: JP13.2 ; also sheet 3
PD4: JP13.1 ; also sheet 3
PE6: JP13.5 ; also sheet 3
RTS: U18.4(A2) U21.16(RTS#)
RXD: U18.5(A3) U21.2(RXD)
RXLED: LED5.C U21.5(CBUS2)
SPI4_MISO: JP12.6 ; also sheet 3
SPI4_MOSI: JP12.2 ; also sheet 3
SPI4_SCK: JP12.4 ; also sheet 3
TXD: U18.3(A1) U21.15(TXD)
TXLED: LED4.C U21.11(CBUS1)
UART6_CTS: U18.11(B4)
UART6_RTS: U18.13(B2)
UART6_RX: JP17.5 U18.12(B3) ; also sheet 3
UART6_TX: JP17.4 U18.14(B1) ; also sheet 3
UART7_RTS: JP12.1 ; also sheet 3
UART7_RX: JP12.5 ; also sheet 3
UART7_TX: JP12.3 ; also sheet 3
USB_D+_P: D6.6 J4.3(D+) ; also sheet 3
USB_D-_N: D6.4 J4.2(D-) ; also sheet 3
USB_N [diff_pair]: R75.1 U21.7(USBDM)
USB_OVERCURRENT: R57.2 R62.2 U19.3(FAULT) ; also sheet 3
USB_P [diff_pair]: R76.1 U21.6(USBDP)
USB_POWER_ON_SWITCH: R59.1 U19.4(EN) ; also sheet 3
USBE_N [diff_pair]: C105.1 D8.6 J5.2(D-) R75.2
USBE_P [diff_pair]: C103.1 D8.4 J5.3(D+) R76.2
VBUS: C109.1 D8.5(VDD) J5.1(VBUS) L6.2
VBUS_EXT: C100.1 C102.1 L6.1 U21.10(VCC)
VBUS_OUT: D6.5(VDD) J4.1(VBUS) Q10.1(G) R66.1 U19.1(OUT)
VCCIO: C22.1 C92.1 C99.1 R70.2 R73.2 U18.1(VDD1) U18.7(EN1) U21.1(VCCIO) U21.8(3V3OUT) U21.9(RESET#)
Unconnected: D6.1 D6.3 D8.1 D8.3 U21.12(CBUS0) U21.14(CBUS3)

### Notes on the sheet
- Extension board - LCD + keys | Rear connector
- Extra pins
- EXT1
- EXT2
- USB flash drive
- UART <--> USB
- Communication indication LED

## Sheet 5 of 5
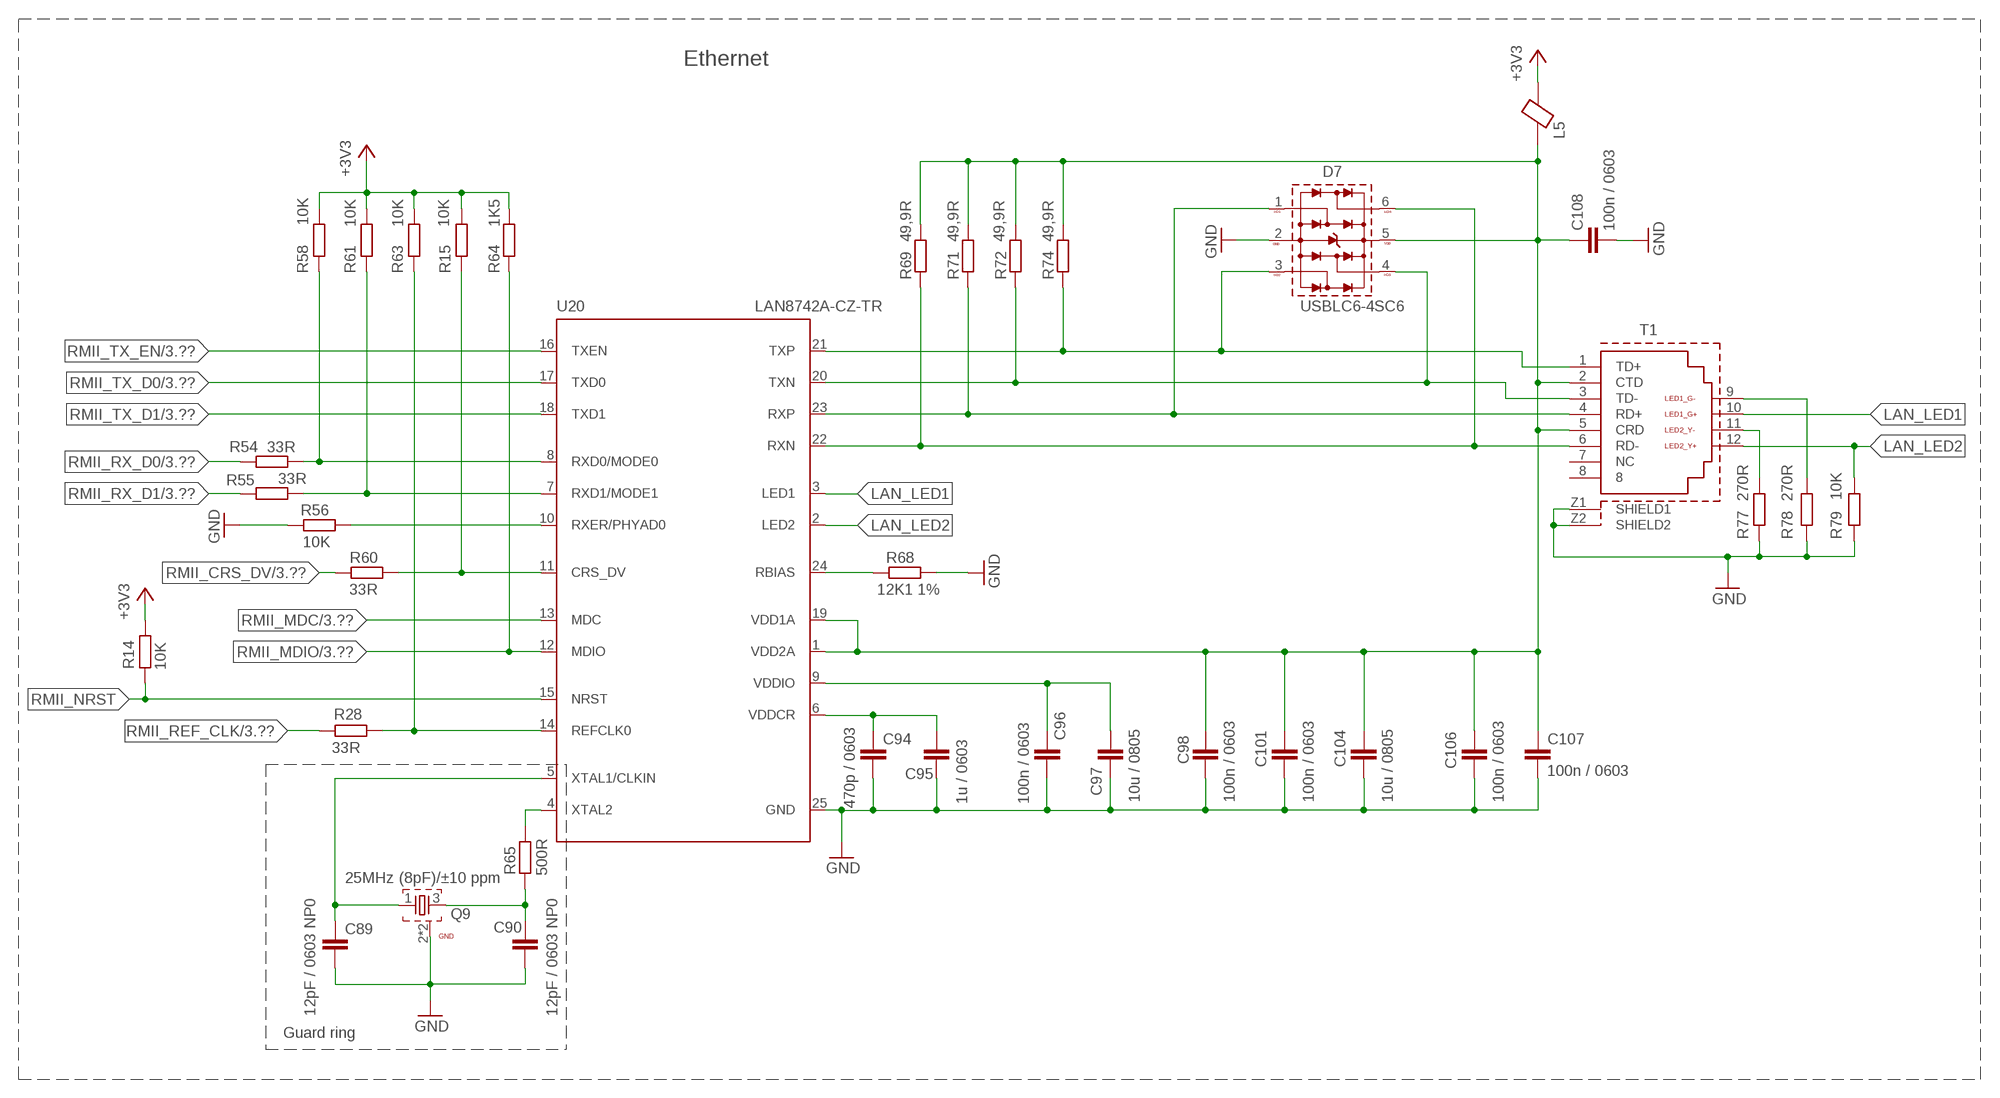
[diagram p5: schematic, sheet 5]

### Parts
C89  12pF / 0603 NP0  C-EUC0603  [C0603]
C90  12pF / 0603 NP0  C-EUC0603  [C0603]
C94  470p / 0603  C-EUC0603  [C0603]
C95  1u / 0603  C-EUC0603  [C0603]
C96  100n / 0603  C-EUC0603  [C0603]
C97  10u / 0805  C-EUC0805  [C0805]
C98  100n / 0603  C-EUC0603  [C0603]
C101  100n / 0603  C-EUC0603  [C0603]
C104  10u / 0805  C-EUC0805  [C0805]
C106  100n / 0603  C-EUC0603  [C0603]
C107  100n / 0603  C-EUC0603  [C0603]
C108  100n / 0603  C-EUC0603  [C0603]
D7  USBLC6-4SC6  WE-TVS-HS_SOT23-6L_824015  [WE-TVS_SOT23-6L]
L5  BLM21PG331SN1D  [BLM21PG331SN1D]
Q9  25MHz (8pF)/±10 ppm  WE-XTAL_CFPX-218_830069381  [WE-XTAL_CFPX-218]
R14  10K  R-EU_R0603  [R0603]
R15  10K  R-EU_R0603  [R0603]
R28  33R  R-EU_R0603  [R0603]
R54  33R  R-EU_R0603  [R0603]
R55  33R  R-EU_R0603  [R0603]
R56  10K  R-EU_R0603  [R0603]
R58  10K  R-EU_R0603  [R0603]
R60  33R  R-EU_R0603  [R0603]
R61  10K  R-EU_R0603  [R0603]
R63  10K  R-EU_R0603  [R0603]
R64  1K5  R-EU_R0603  [R0603]
R65  500R  R-EU_R0603  [R0603]
R68  12K1 1%  R-EU_R0603  [R0603]
R69  49,9R  R-EU_R0603  [R0603]
R71  49,9R  R-EU_R0603  [R0603]
R72  49,9R  R-EU_R0603  [R0603]
R74  49,9R  R-EU_R0603  [R0603]
R77  270R  R-EU_R0603  [R0603]
R78  270R  R-EU_R0603  [R0603]
R79  10K  R-EU_R0603  [R0603]
T1  WE-RJ45_7499010121A  [7499010121A]
U20  LAN8742A-CZ-TR  [24-VFQFN]

### Nets
+3V3: L5.1 R14.1 R15.1 R58.1 R61.1 R63.1 R64.1 ; also sheet 1,2,3,4
GND: C89.2 C90.2 C94.2 C95.2 C96.2 C97.2 C98.2 C101.2 C104.2 C106.2 C107.2 C108.2 D7.2(GND) Q9.2(GND) Q9.4(GND) R56.2 R68.1 R77.1 R78.1 R79.1 T1.Z1(SHIELD1) T1.Z2(SHIELD2) U20.25(GND) ; also sheet 2,3,4
LAN_LED1: T1.10(LED1_G+) U20.3(LED1)
LAN_LED2: R79.2 T1.12(LED2_Y+) U20.2(LED2)
N$75: R78.2 T1.9(LED1_G-)
N$76: R65.1 U20.4(XTAL2)
N$77: R68.2 U20.24(RBIAS)
N$79: C98.1 C101.1 C104.1 C106.1 C107.1 C108.1 D7.5(VDD) L5.2 R69.2 R71.2 R72.2 R74.2 T1.2(CTD) T1.5(CRD) U20.1(VDD2A) U20.19(VDD1A)
N$80: C96.1 C97.1 U20.9(VDDIO)
N$81: C94.1 C95.1 U20.6(VDDCR)
N$83: C90.1 Q9.3 R65.2
N$84: C89.1 Q9.1 U20.5(XTAL1/CLKIN)
N$96: R77.2 T1.11(LED2_Y-)
RMII_CRS_DV: R60.2 ; also sheet 3
RMII_CRS_DV_: R15.2 R60.1 U20.11(CRS_DV)
RMII_MDC: U20.13(MDC) ; also sheet 3
RMII_MDIO: R64.2 U20.12(MDIO) ; also sheet 3
RMII_NRST: R14.2 U20.15(NRST)
RMII_REF_CLK: R28.2 ; also sheet 3
RMII_REF_CLK_IC: R28.1 R63.2 U20.14(REFCLK0)
RMII_RX_D0: R54.2 ; also sheet 3
RMII_RX_D0_: R54.1 R58.2 U20.8(RXD0/MODE0)
RMII_RX_D1: R55.2 ; also sheet 3
RMII_RX_D1_: R55.1 R61.2 U20.7(RXD1/MODE1)
RMII_RX_ER: R56.1 U20.10(RXER/PHYAD0)
RMII_TX_D0: U20.17(TXD0) ; also sheet 3
RMII_TX_D1: U20.18(TXD1) ; also sheet 3
RMII_TX_EN: U20.16(TXEN) ; also sheet 3
RX_N: D7.6 R69.1 T1.6(RD-) U20.22(RXN)
RX_P: D7.1 R71.1 T1.4(RD+) U20.23(RXP)
TX_N: D7.4 R72.1 T1.3(TD-) U20.20(TXN)
TX_P: D7.3 R74.1 T1.1(TD+) U20.21(TXP)
Unconnected: T1.7(NC) T1.8

### Notes on the sheet
- Ethernet
- Guard ring

## Library data of the parts
C1-C30 C32-C34 C36-C43 C47-C50 C53-C60 C62 C63 C72-C109 = rcl:C-EU: CAPACITOR, European symbol; SPICEPREFIX: C
C35 C45 C51 C52 = rcl:CPOL-EU: POLARIZED CAPACITOR, European symbol; SPICEPREFIX: C
D1 D11 = DIODE:S1M
D2-D5 D10 = diode:CGRM400*-G: Molded plasitc,JEDEC SOD-123/Mini SMA Source: Comchip CGRM4001-G.pdf
D6-D8 = Wurth_EMC Components_WE-TVS:WE-TVS-HS_SOT23-6L_824015: WE-TVS TVS Diode – High Speed Series Characteristics Low clamping voltage Sturdy design Very low capacitance Flow Thru Design for a simple layout Rail to Rail protection Epoxy flame resistant UL94-V0 RoHS, REACH and free of halogens Applications Very fast data lines USB 2.0 Ethernet PoE VGA Sim Cards Keypads HS = High Speed <https://katalog.we-online.com/media/images/v2/o14883v209%20Family_WE-TVS_HIGHSPEED.> Details see: https://katalog.we-online.com/en/pbs/WE-TVS-HS Updated by Ella Wu 2019-07-12 2019 (C) Wurth Elektronik; C-CH: 2pF; CHANNELS: 4+1; DATASHEET-URL: https://katalog.we-online.com/pbs/datasheet/824015.pdf; IPEAK: 12A; MOUNT: SMT; PART-NUMBER: 824015; VALUE: 5Vdc; VBR: 6.1V
D9 = Diode:ZENER_: Zener Diode - Popular parts; CATEGORY: Diode; DESCRIPTION: DIODE ZENER 10V 500MW SOD123; MANUFACTURER: ON Semiconductor; MPN: MMSZ5240BT1G; SUB-CATEGORY: Zener; THERMALLOSS: 0.5W
F1 = Thermistor_Inductors:MF-MSMF050-2: PTC RESET FUSE 15V 500MA 1812 Manufacturer's datasheet <https://www.bourns.com/docs/Product-Datasheets/mfmsmf.pdf>; CREATED_BY: PCBLayout.com; DIGIKEY_PART_NUMBER: MF-MSMF050-2TR-ND; MANUFACTURER: Bourns Inc.; MPN: MF-MSMF050-2; PACKAGE: 1812
H1-H4 = holes:MOUNT-HOLE: MOUNTING HOLE with drill center marker
J3 = Wurth_Elektronik_Electromechanic_Input-Output_Connectors_rev19d:693063020911: WR-CRD SD CARD CONNECTOR PUSH & PULL SHORT TYPE WITH CARD DETECTION 9PINS=>Code : Con_I-O_COM_CRD_SD_Normal_693063020911 <http://katalog.we-online.de/media/images/eican/Con_I-O_COM_CRD_SD_Normal_693063020911_pf2.jpg> Details see: http://katalog.we-online.de/en/em/CRD_SD_PUSH_AND_PULL_CRD_DETETCION_SHORT_TYPE_9_PINS/693063020911 Created 2014-07-09, Karrer Zheng 2014 (C) Würth Elektronik
J4 = Wurth_Connectors_WR-USB:614004190021: WR-COM USB 2.0 Type A Horizontal THT Kind Properties Durability:1 500 Mating cycles Quality Class:1 500 Mating cycles Connector Type:USB Gender:Receptacle Type:Horizontal General Information Operating Temperature:-40up to +85 °C Compliance:RoHS Electrical Properties IR 1:3A Working Voltage:30V (AC) Withstanding Voltage:500 V (AC) Contact Resistance:30 mΩ Material Properties Insulator Material:PBT Insulator Flammability Rating:UL94 V-0 Color:White Cover Material:Brass Cover Plating:Nickel Contact Material:Brass Contact Plating:Gold Contact Type:Stamped <https://www.we-online.com/catalog/media/o58996v209%20Family_WR-COM_614004190021_4C.jpg> Details see: https://www.we-online.com/catalog/en/COM_2_0_THT_TYPE_A_HORIZONTAL/ Updated by Yingchun, Shan 2020-01-14 2020 (C) Würth Elektronik; APPLICATION: USB 2.0; DATASHEET-URL: https://www.we-online.com/catalog/datasheet/614004190021.pdf; GERDER: Receptacle; INTERFACE-TYPE: Type A; IR1: 3.0A; MOUNT: THT; PACKAGING: Tray; PART-NUMBER: 614004190021; PINS: 4; TYPE: Horizontal; WORKING-VOLTAGE: 30V(AC)
J5 = Wurth_Connectors_WR-USB:61400416121: WR-COM USB 2.0 Horizontal THT Kind Properties Durability:1500 Mating cycles Quality Class:1 500 Mating cycles Connector Type:USB Gender:Female Type:Horizontal General Information Operating Temperature:-40up to +105 °C Compliance:RoHS Electrical Properties IR 1:1.5 A Working Voltage:30V (AC) Withstanding Voltage:750V (AC) Contact Resistance:20 mΩ Material Properties Insulator Material:PBT Insulator Flammability Rating:UL94 V-0 Color:White Cover Material:Brass Cover Plating:Nickel Contact Material:Copper Alloy Contact Plating:Selective Gold Contact Type:Stamped Shielding Material:Brass Shielding Plating:Nickel <https://www.we-online.com/catalog/media/o32985v209%20Family_WR-COM_61400416121.jpg> Details see: https://www.we-online.com/catalog/en/COM_TYPE_B_HORIZONTAL/ Updated by Yingchun, Shan 2020-01-16 2020 (C) Würth Elektronik; APPLICATION: USB 2.0; DATASHEET-URL: https://www.we-online.com/catalog/datasheet/61400416121.pdf; GERDER: Female; INTERFACE-TYPE: Type B; IR1: 1.5A; MOUNT: THT; PACKAGING: Tray; PART-NUMBER: 61400416121; PINS: 4; TYPE: Horizontal; WORKING-VOLTAGE: 30V(AC)
JP1-JP5 JP16 = pinhead:PINHD-1X1: PIN HEADER
JP6-JP11 JP14 = pinhead:PINHD-1X2: PIN HEADER
JP12 = pinhead:PINHD-2X5: PIN HEADER
JP13 = pinhead:PINHD-2X4: PIN HEADER
JP17 JP25 = pinhead:PINHD-1X6: PIN HEADER
JP24 = pinhead:PINHD-2X8: PIN HEADER
L1 L2 L4-L7 = Thermistor_Inductors:BLM21PG331SN1D: FERRITE BEAD 330 OHM 0805 1LN Manufacturer's datasheet <https://www.murata.com/en-us/products/en-us/products/productdata/8796738977822/ENFA0005.pdf>; CREATED_BY: PCBLayout.com; DIGIKEY_PART_NUMBER: 490-5988-2-ND; MANUFACTURER: Murata Electronics North America; MPN: BLM21PG331SN1D; PACKAGE: 0805
LED1-LED10 LED12 = led:LED: LED OSRAM: - CHIPLED LG R971, LG N971, LY N971, LG Q971, LY Q971, LO R971, LY R971 LH N974, LH R974 LS Q976, LO Q976, LY Q976 LO Q996 - Hyper CHIPLED LW Q18S LB Q993, LB Q99A, LB R99A - SideLED LS A670, LO A670, LY A670, LG A670, LP A670 LB A673, LV A673, LT A673, LW A673 LH A674 LY A675 LS A676, LA A676, LO A676, LY A676, LW A676 LS A679, LY A679, LG A679 - Hyper Micro SIDELED® LS Y876, LA Y876, LO Y876, LY Y876 LT Y87S - SmartLED LW L88C, LW L88S LB L89C, LB L89S, LG L890 LS L89K, LO L89K, LY L89K LS L896, LA L896, LO L896, LY L896 - TOPLED LS T670, LO T670, LY T670, LG T670, LP T670 LSG T670, LSP T670, LSY T670, LOP T670, LYG T670 LG T671, LOG T671, LSG T671 LB T673, LV T673, LT T673, LW T673 LH T674 LS T676, LA T676, LO T676, LY T676, LB T676, LH T676, LSB T676, LW T676 LB T67C, LV T67C, LT T67C, LS T67K, LO T67K, LY T67K, LW E67C LS E67B, LA E67B, LO E67B, LY E67B, LB E67C, LV E67C, LT E67C LW T67C LS T679, LY T679, LG T679 LS T770, LO T770, LY T770, LG T770, LP T770 LB T773, LV T773, LT T773, LW T773 LH T774 LS E675, LA E675, LY E675, LS T675 LS T776, LA T776, LO T776, LY T776, LB T776 LHGB T686 LT T68C, LB T68C - Hyper Mini TOPLED® LB M676 - Mini TOPLED Santana® LG M470 LS M47K, LO M47K, LY M47K Source: http://www.osram.convergy.de LUXEON: - LUMILED® LXK2-PW12-R00, LXK2-PW12-S00, LXK2-PW14-U00, LXK2-PW14-V00 LXK2-PM12-R00, LXK2-PM12-S00, LXK2-PM14-U00 LXK2-PE12-Q00, LXK2-PE12-R00, LXK2-PE12-S00, LXK2-PE14-T00, LXK2-PE14-U00 LXK2-PB12-K00, LXK2-PB12-L00, LXK2-PB12-M00, LXK2-PB14-N00, LXK2-PB14-P00, LXK2-PB14-Q00 LXK2-PR12-L00, LXK2-PR12-M00, LXK2-PR14-Q00, LXK2-PR14-R00 LXK2-PD12-Q00, LXK2-PD12-R00, LXK2-PD12-S00 LXK2-PH12-R00, LXK2-PH12-S00 LXK2-PL12-P00, LXK2-PL12-Q00, LXK2-PL12-R00 Source: www.luxeon.com KINGBRIGHT: KA-3528ASYC Source: www.kingbright.com
PAD1-PAD8 = wirepad:WIREPAD: Wire PAD connect wire on PCB
Q1 Q10 = DMG_transistor:DMG3414UQ-7
Q3 = DMG_transistor:DMG3401LSN-7
Q4 = BJT:PHPT60603NYX
Q7 = Wurth_Elektronik_Passive_rev19e:WE-XTAL_IQXC-25: WE-XTAL Quartz Crystal Characteristics Industry standard packages <https://katalog.we-online.com/media/images/v2/o135919v209%20Family_WE-XTAL.jpg> Details see: https://katalog.we-online.com/en/pbs/WE-XTAL Created by Yingchun Shan,2018-11-19 2018 (C) Wurth Elektronik; VALUE: 0.032768MHz; WE-NUMBER: 830062558
Q8 Q9 = Wurth_Elektronik_Passive_rev19e:WE-XTAL_CFPX-218: WE-XTAL Quartz Crystal Characteristics Industry standard packages <https://katalog.we-online.com/media/images/v2/o135919v209%20Family_WE-XTAL.jpg> Details see: https://katalog.we-online.com/en/pbs/WE-XTAL Created by Yingchun Shan,2018-11-19 2018 (C) Wurth Elektronik; VALUE: 20MHz/±20 ppm; WE-NUMBER: 830069381
Q11 = DMG_transistor:DMN2009USS
R1 R2 R4-R17 R19-R28 R34-R38 R40 R52-R89 = rcl:R-EU_: RESISTOR, European symbol; SPICEPREFIX: R
R3 = RLC_special:CSM_R01
S1 = Wurth_Switch_WS-TASV:430152080836: WS-TASV SMT Tact Switch 6x6 mm Material Properties Cover Material : Stainless Steel Properties Actuator Material:LCP Actuator Flammability :UL94 V-0 Rating Actuator Color:Black; Salmon; White Frame Material:LCP Flammability Rating:UL94 V-0 Frame Color:Black Contact Material:Stainless Steel Contact Plating:Silver Terminal Material:Copper Alloy Terminal Plating:Silver VR:12 V (DC) Contact Resistance Initial:100 mΩ Contact Resistance After Life Test:2Ω RISO:100 MΩ Withstanding Voltage:250 V (AC) Washable:No Qty.:4000;5000 Mechanical Properties Electrical Life:400; 550; 1000 Stroke :0.25 mm General Information Operating Temperature:-40 up to +85 °C Washable:No Packaging Properties Packaging:Tape and Reel <https://www.we-online.com/catalog/media/o37470v209%20Family_WS-TASV_6x6mm_SMD_Tact_Switch_4301820xx8xx.jpg> Details see: https://www.we-online.com/catalog/en/TASV_6X6_SMD/ Updated by yingchun,Shan;2020-02-18 2020(C) Würth Elektronik; DATASHEET-URL: https://www.we-online.com/catalog/datasheet/430152080836.pdf; H: 8mm; OPERATION-FORCE: 360g; PART-NUMBER: 430152080836; QTY: 400
SJ27 = jumper:SJ2W: SMD solder JUMPER
T1 = Wurth_Signal & Communications_WE-RJ45_LAN:WE-RJ45_7499010121A: WE-RJ45 LAN Transformer Characteristics RJ45 Connector with integrated transformer / common mode choke Power over Ethernet up to 50 Watt and speeds up to 10 Gbit/s Available in SMD, THT and THT with USB Compliant with standards: IEEE 802.3u, IEEE 802.3ab, IEEE 802.3af, IEEE 802.3at, IEEE 802.3an and upcoming IEE 802.3bt Applications Suitable for industrial temperatures from –40 °C up to +85 °C Compatible to Industrial Ethernet systems like EtherCAT or Profinet Compliant with most IC’s for Ethernet applications such as Microchip, Texas Instruments, Broadcom, Linear Technology Hubs, Routers, Switches, IP cameras, IoT applications <https://katalog.we-online.com/media/images/v2/o35731v209%20Family_WE-RJ45-LAN.jpg> Details see: https://katalog.we-online.com/en/pbs/WE-LAN-RJ45 Updated by Ella Wu 2019-08-05 2019 (C) Wurth Elektronik; DATA-RATE: 10/100 Base-T; DATASHEET-URL: https://katalog.we-online.com/pbs/datasheet/7499010121A.pdf; LED: yellow-green; MOUNT: THT; PART-NUMBER: 7499010121A; POE: non-PoE; PORTS: 1; USB: No
TP1-TP15 TP30 TP31 = testpad:TPS: TEST PIN
U1 = TMUX1111:TMUX1111PWR
U2 U3 U5 = MAX4239:MAX4239AUT+T
U4 = REF5050IDR:REF5050IDR: Low-Noise, Very Low Drift, Precision VOLTAGE REFERENCE; AVAILABILITY: Unavailable; DESCRIPTION: Low Noise, Very Low Drift, Precision VOLTAGE REFERENCE 8-SOIC -40 to 125; MF: Texas Instruments; MP: REF5050IDR; PACKAGE: SOIC-8 Texas Instruments; PRICE: None
U6 = ADC:ADS8910BRGET
U7 = ADC:ADS8681IPWR
U8 = LK112M:LK112M60TR
U9 U13 = TLV76701DRVT:TLV76701DRVT: LDO Voltage Regulators LOW-COST 1A MEDIUM VOLTAGE LDO ADJ; AVAILABILITY: Unavailable; DESCRIPTION: Linear Voltage Regulator IC 1 Output 1A 6-WSON _2x2_; MF: Texas Instruments; MP: TLV76701DRVT; PACKAGE: WDFN-6 Texas Instruments; PRICE: None
U11 U12 = AD5259BRMZ5:AD5259BRMZ5: Digital Potentiometer 256POS 5kOhm Single Automotive 10-Pin MSOP Tube; AVAILABILITY: Unavailable; DESCRIPTION: Digital Potentiometer 5k Ohm 1 Circuit 256 Taps I²C Interface 10-MSOP; MF: Analog Devices; MP: AD5259BRMZ5; PACKAGE: MSOP-10 Analog Devices; PRICE: None
U16 = STM32F745VET6:STM32F745VET6: MCU 32-Bit STM32 ARM Cortex M7 RISC 512KB Flash 1.8V/2.5V/3.3V 100-Pin LQFP Tray; AVAILABILITY: Unavailable; DESCRIPTION: ARM® Cortex®-M7 STM32F7 Microcontroller IC 32-Bit 216MHz 512KB _512K x 8_ FLASH 100-LQFP _14x14_; MF: STMicroelectronics; MP: STM32F745VET6; PACKAGE: LQFP-100 STMicroelectronics; PRICE: None
U17 = AT24C256C-SSHL-T:AT24C256C-SSHL-T: EEPROM Serial-2Wire 256K-bit 32K x 8 1.8V/2.5V/3.3V/5V 8-Pin SOIC Bulk; AVAILABILITY: Unavailable; DESCRIPTION: EEPROM Memory IC 256Kb _32K x 8_ I²C 1MHz 550ns 8-SOIC; MF: Microchip; MP: AT24C256C-SSHL-T; PACKAGE: SO-8 Microchip; PRICE: None
U18 = Si8642:SI8642BB-B-IU
U19 = STMPS2151STR:STMPS2151STR
U20 = LAN8742:LAN8742A-CZ-TR
U21 = FT232:FT232XQ-R
U22 = LT1761ES5-5TRMPBF:LT1761ES5-5TRMPBF: 100mA, Low Noise, LDO Micropower Regulators; AVAILABILITY: Unavailable; DESCRIPTION: LDO Regulator Pos 5V 0.1A Automotive 5-Pin TSOT-23 T/R; MF: Analog Devices; MP: LT1761ES5-5#TRMPBF; PACKAGE: SOT-23-5 Analog Devices; PRICE: None
VR1 VR2 = LT3045EDD_TRPBF:LT3045EDD#TRPBF: LT3045 - 20V, 500mA, Ultralow Noise, Ultrahigh PSRR Linear Regulator; AVAILABILITY: Unavailable; DESCRIPTION: LDO Regulator Pos 0V to 15V 0.5A Automotive 10-Pin DFN EP T/R; MF: Analog Devices; MP: LT3045EDD#TRPBF; PACKAGE: DFN -10 Analog Devices; PRICE: None
X1 = DC_jack:DCBARREL: 2.0mm DC Barrel Jack DCJACK_2MM_PTH - Through Hole Jack (4UConnector: 05537)

## Net classes
1 diff_pair: width 0.152 mm